# EAGLE schematic VM_Motor_v0t (EAGLE 7.0.0)
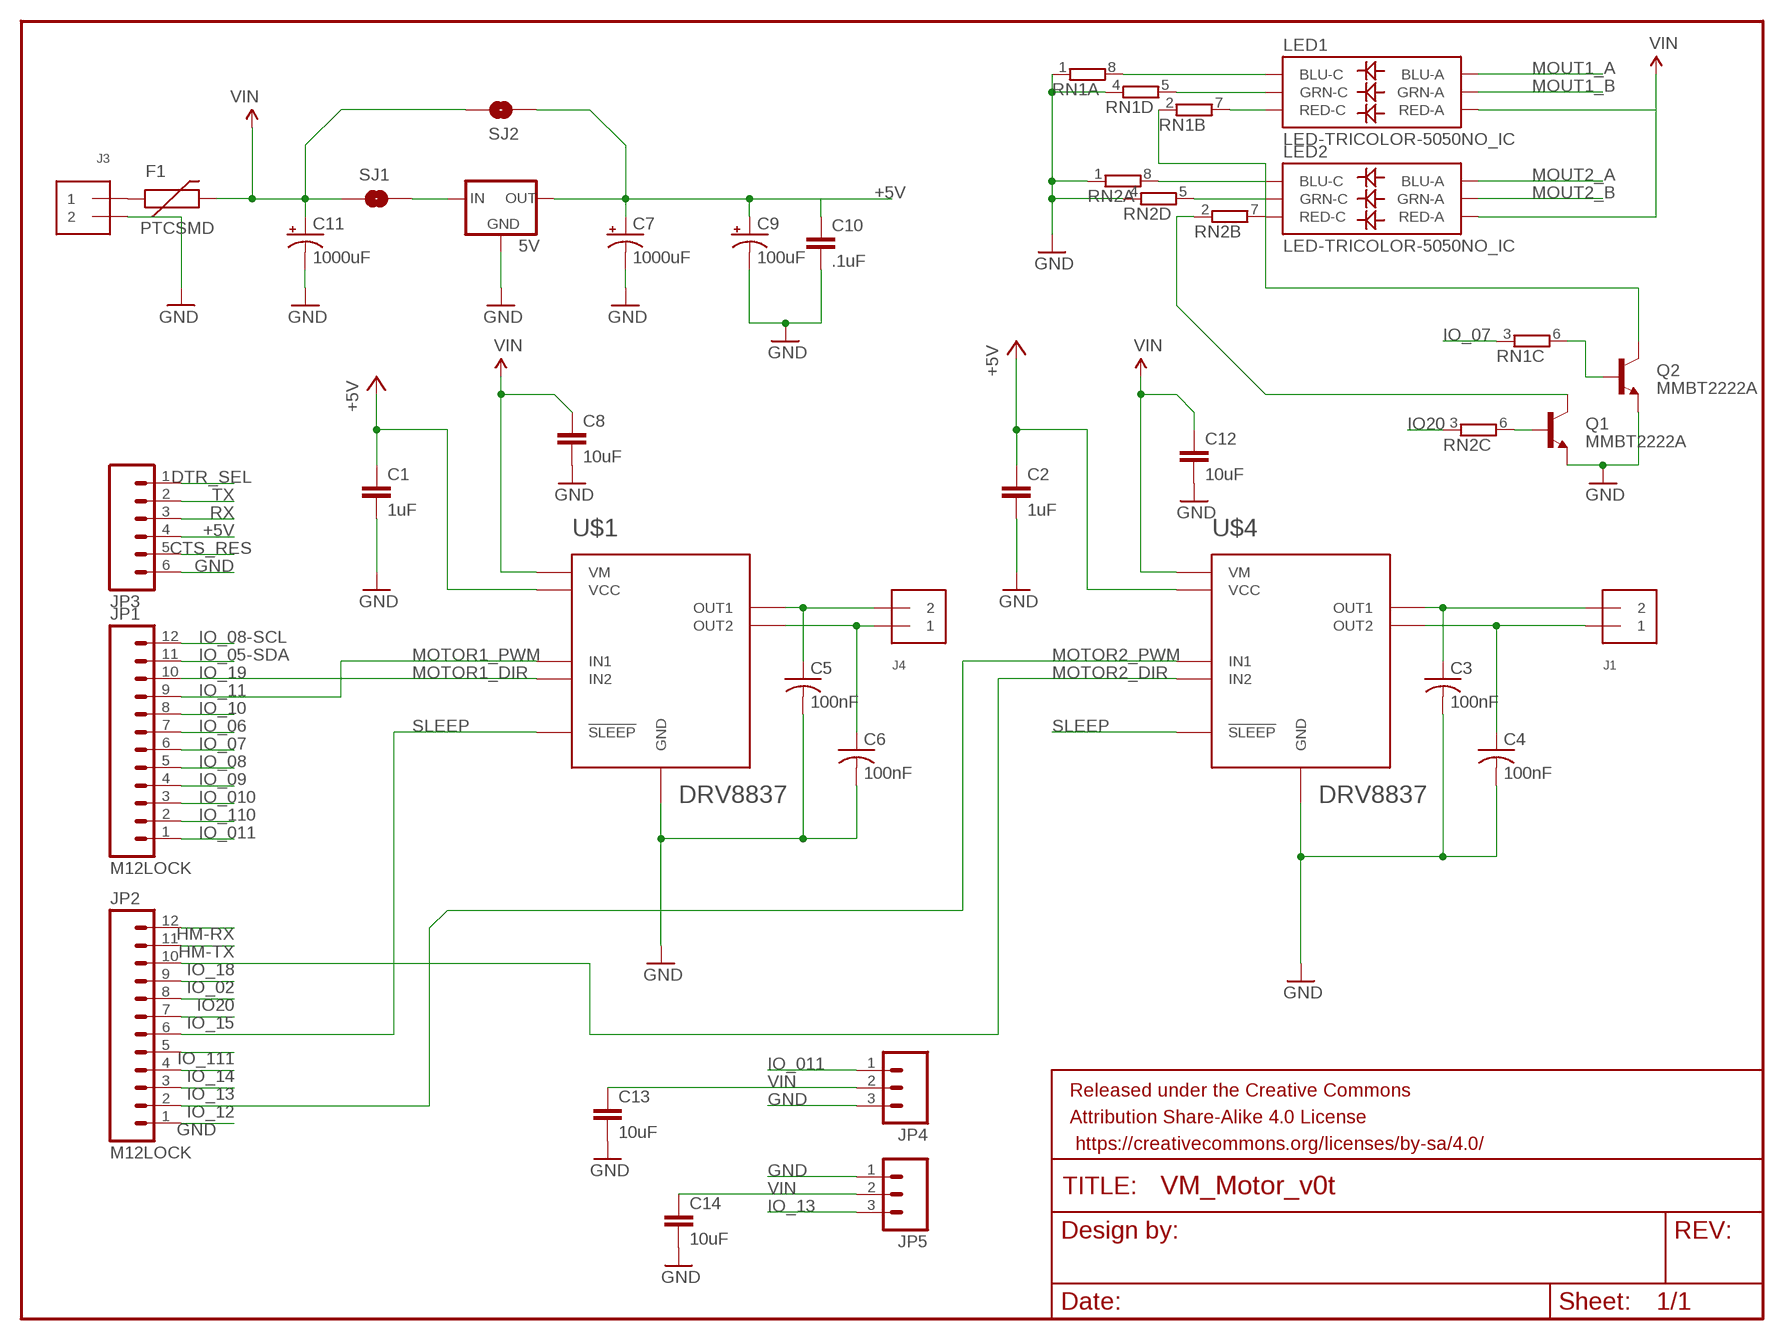
[diagram p0: schematic, sheet 1]

## Parts
5V  V_REG_MC33269DT  [DPAK]
C1  1uF  CAP0402-CAP  [0402-CAP]
C2  1uF  CAP0402-CAP  [0402-CAP]
C3  100nF  C-USC0402  [C0402]
C4  100nF  C-USC0402  [C0402]
C5  100nF  C-USC0402  [C0402]
C6  100nF  C-USC0402  [C0402]
C7  1000uF  CPOL-US140CLH-0810  [140CLH-0810]
C8  10uF  CAP0402-CAP  [0402-CAP]
C9  100uF  CAP_POL3528-KIT  [EIA3528-KIT]
C10  .1uF  CAP0402-CAP  [0402-CAP]
C11  1000uF  CPOL-US140CLH-0810  [140CLH-0810]
C12  10uF  CAP0402-CAP  [0402-CAP]
C13  10uF  CAP0402-CAP  [0402-CAP]
C14  10uF  CAP0402-CAP  [0402-CAP]
F1  PTCSMD  [PTC-1206]
FRAME1  FRAME-LETTER  [CREATIVE_COMMONS]
J1  TERMBLOCK_1X2  [TERMBLOCK_1X2-3.5MM]
J3  TERMBLOCK_1X2  [TERMBLOCK_1X2-3.5MM]
J4  TERMBLOCK_1X2  [TERMBLOCK_1X2-3.5MM]
JP1  M12LOCK  [1X12_LOCK]
JP2  M12LOCK  [1X12_LOCK]
JP3  M06LOCK  [1X06_LOCK]
JP4  M03LOCK  [1X03_LOCK]
JP5  M03LOCK  [1X03_LOCK]
LED1  LED-TRICOLOR-5050NO_IC  [LED-TRICOLOR-5050]
LED2  LED-TRICOLOR-5050NO_IC  [LED-TRICOLOR-5050]
Q1  MMBT2222A  TRANSISTOR_NPNMMBT2222A  [SOT23-3]
Q2  MMBT2222A  TRANSISTOR_NPNMMBT2222A  [SOT23-3]
RN1  4R-N0402ARV341  [4X0402ARV341]
RN2  4R-N0402ARV341  [4X0402ARV341]
SJ1  SOLDERJUMPERNO  [SJ_2S-NO]
SJ2  SOLDERJUMPERNO  [SJ_2S-NO]
U$1  DRV8837  [QFN8]
U$4  DRV8837  [QFN8]

## Nets
+5V: 5V.4(OUT) C1.1 C2.1 C7.+ C9.A(+) C10.1 JP3.4 SJ2.1 U$1.P$8(VCC) U$4.P$8(VCC)
CTS_RES: JP3.5
DTR_SEL: JP3.1
GND: 5V.1(GND) C1.2 C2.2 C3.2 C4.2 C5.2 C6.2 C7.- C8.2 C9.C(-) C10.2 C11.- C12.2 C13.2 C14.2 J3.2 JP2.1 JP3.6 JP4.3 JP5.1 Q1.2(E) Q2.2(E) RN1.1 RN1.4 RN2.1 RN2.4 U$1.P$4(GND) U$1.P$9(GND) U$1.P$10(GND) U$1.P$11(GND) U$4.P$4(GND) U$4.P$9(GND) U$4.P$10(GND) U$4.P$11(GND)
HM-RX: JP2.12
HM-TX: JP2.11
IO20: JP2.8 RN2.3
IO_02: JP2.9
IO_05-SDA: JP1.11
IO_06: JP1.7
IO_07: JP1.6 RN1.3
IO_08: JP1.5
IO_08-SCL: JP1.12
IO_09: JP1.4
IO_10: JP1.8
IO_010: JP1.3
IO_011: JP1.1 JP4.1
IO_13: JP2.3 JP5.3
IO_14: JP2.4
IO_15: JP2.7
IO_110: JP1.2
IO_111: JP2.5
MOTOR1_DIR: JP1.10 U$1.P$5(IN2)
MOTOR1_PWM: JP1.9 U$1.P$6(IN1)
MOTOR2_DIR: JP2.10 U$4.P$5(IN2)
MOTOR2_PWM: JP2.2 U$4.P$6(IN1)
MOUT1_A: C5.1 J4.2 LED1.3(BLU-A) U$1.P$2(OUT1)
MOUT1_B: C6.1 J4.1 LED1.1(GRN-A) U$1.P$3(OUT2)
MOUT2_A: C3.1 J1.2 LED2.3(BLU-A) U$4.P$2(OUT1)
MOUT2_B: C4.1 J1.1 LED2.1(GRN-A) U$4.P$3(OUT2)
N$2: Q1.1(B) RN2.6
N$3: LED1.4(BLU-C) RN1.8
N$4: LED1.6(GRN-C) RN1.5
N$5: LED2.4(BLU-C) RN2.8
N$7: LED1.5(RED-C) RN1.7
N$8: Q1.3(C) RN2.2
N$9: Q2.3(C) RN1.2
N$10: Q2.1(B) RN1.6
N$11: LED2.6(GRN-C) RN2.5
N$12: LED2.5(RED-C) RN2.7
N$13: F1.1 J3.1
N$14: 5V.3(IN) SJ1.2
RX: JP3.3
SLEEP: JP2.6 U$1.P$7(!SLEEP) U$4.P$7(!SLEEP)
TX: JP3.2
VIN: C8.1 C11.+ C12.1 C13.1 C14.1 F1.2 JP4.2 JP5.2 LED1.2(RED-A) LED2.2(RED-A) SJ1.1 SJ2.2 U$1.P$1(VM) U$4.P$1(VM)

## Notes on the sheet
- IO_19
- IO_11
- IO_18
- IO_12

## Library data of the parts
5V = SparkFun-PowerIC:V_REG_MC33269
C1 C2 C8 C10 C12-C14 = SparkFun-Capacitors:CAP: Capacitor Standard 0603 ceramic capacitor, and 0.1" leaded capacitor.
C3-C6 = resistor:C-US: CAPACITOR, American symbol
C7 C11 = resistor:CPOL-US: POLARIZED CAPACITOR, American symbol
C9 = SparkFun-Capacitors:CAP_POL: Capacitor Polarized These are standard SMD and PTH capacitors. Normally 10uF, 47uF, and 100uF in electrolytic and tantalum varieties. Always verify the external diameter of the through hole cap, it varies with capacity, voltage, and manufacturer. The EIA devices should be standard.
F1 = SparkFun-PowerIC:PTC: Resettable Fuse PTC Resettable Fuse. Spark Fun Electronics SKU : COM-08357; PROD_ID: RES-11150
FRAME1 = SparkFun-Aesthetics:FRAME-LETTER: Schematic Frame Standard 8.5x11 US Letter frame
J1 J3 J4 = microbuilder:TERMBLOCK_1X2: 3.5mm Terminal block http://www.ladyada.net/library/pcb/eaglelibrary.html
JP1 JP2 = SparkFun-Connectors:M12: Header 12 Standard 12-pin 0.1" header. Use with straight break away headers (SKU : PRT-00116), right angle break away headers (PRT-00553), swiss pins (PRT-00743), machine pins (PRT-00117), and female headers (PRT-00115).
JP3 = SparkFun-Connectors:M06: Header 6 Standard 6-pin 0.1" header. Use with straight break away headers (SKU : PRT-00116), right angle break away headers (PRT-00553), swiss pins (PRT-00743), machine pins (PRT-00117), and female headers (PRT-00115). Molex polarized connector foot print use with SKU : PRT-08094 with associated crimp pins and housings. NOTES ON THE VARIANTS LOCK and LOCK_LONGPADS... This footprint was designed to help hold the alignment of a through-hole component (i.e. 6-pin header) while soldering it into place. You may notice that each hole has been shifted either up or down by 0.005 of an inch from it's more standard position (which is a perfectly straight line). This slight alteration caused the pins (the squares in the middle) to touch the edges of the holes. Because they are alternating, it causes a "brace" to hold the component in place. 0.005 has proven to be the perfect amount of "off-center" position when using our standard breakaway headers. Although looks a little odd when you look at the bare footprint, once you have a header in there, the alteration is very hard to notice. Also,if you push a header all the way into place, it is covered up entirely on the bottom side. This idea of altering the position of holes to aid alignment will be further integrated into the Sparkfun Library for other footprints. It can help hold any component with 3 or more connection pins.
JP4 JP5 = SparkFun-Connectors:M03: Header 3 Standard 3-pin 0.1" header. Use with straight break away headers (SKU : PRT-00116), right angle break away headers (PRT-00553), swiss pins (PRT-00743), machine pins (PRT-00117), and female headers (PRT-00115). Molex polarized connector foot print use with SKU : PRT-08232 with associated crimp pins and housings.
LED1 LED2 = SparkFun-LED:LED-TRICOLOR-5050
Q1 Q2 = SparkFun-DiscreteSemi:TRANSISTOR_NPN: Generic NPN BJT MMBT2222A - TRANS-08049 (SOT-23, 1A 40V) MPSA42 - TRANS-09116 (SOT-23, 500mA 300V) MMBT5088LT1G - TRANS-11160 (SOT-23, 50 mA 30V) BC547 - COM-08928 <http://www.sparkfun.com/products/8928> (TO-92 45V 100mA) (1.Collector 2.Base 3.Emitter) 2N3904 - COM-00521 <http://www.sparkfun.com/products/521> (TO-92 40V 200mA) (1.Emitter 2.Base 3.Collector) P2N2222A - COM-12852 <http://www.sparkfun.com/products/12852> (TO-92 40V 600mA) (1.Collector 2.Base 3.Emitter); PROD_ID: TRANS-08049
RN1 RN2 = resistor-dil:4R-N: Array Chip Resistor Source: RS Component / Phycomp; OC_FARNELL: unknown; OC_NEWARK: unknown
SJ1 SJ2 = SparkFun-Retired:SOLDERJUMPER: Solder Jumper Standard SMD solder jumper. Used to automate production. Two varients : Normally Open and Normally Closed are the same, but have different paste layers. NC will have a large amount of paste and should jumper during reflow.
U$1 U$4 = bt_motordriver:DRV8837: DRV8837 Low Voltage H-Bridge The DRV8837 provides an integrated motor-driver solution for cameras, consumer products, toys, and other low-voltage or battery-powered motion-control applications. The device has one H-bridge driver, and can drive one dc motor or one winding of a stepper motor, as well as other devices like solenoids. Reference: http://www.ti.com/lit/ds/symlink/drv8837.pdf